# EAGLE design 2MBSIMMDIP (EAGLE 6.6.0)
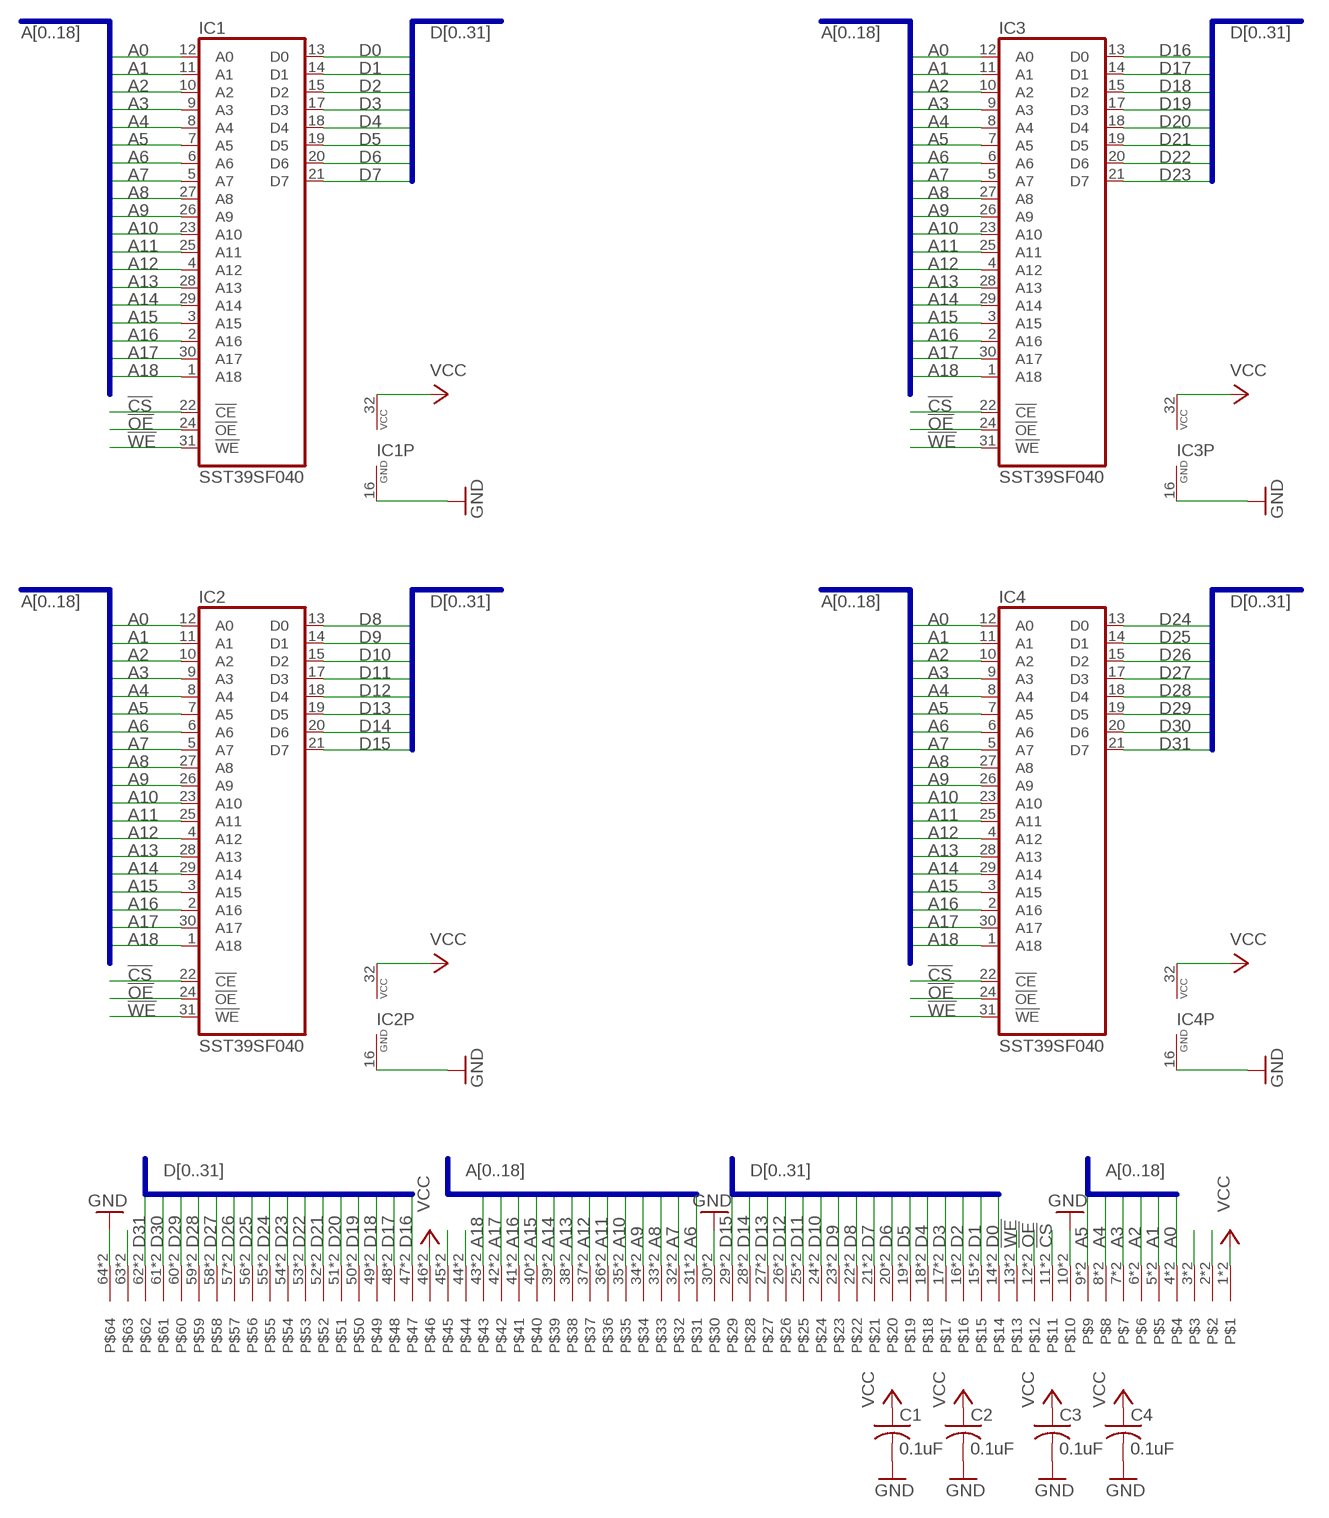
[diagram p0: schematic, sheet 1]

## Parts
C1  0.1uF  C-USC1206  [C1206]
C2  0.1uF  C-USC1206  [C1206]
C3  0.1uF  C-USC1206  [C1206]
C4  0.1uF  C-USC1206  [C1206]
CON1  MYSIMM  [SIMM64L]
IC1  SST39SF040  [DIL32-6]
IC2  SST39SF040  [DIL32-6]
IC3  SST39SF040  [DIL32-6]
IC4  SST39SF040  [DIL32-6]

## Nets
!CS: CON1.11 CON1.75 IC1.22(!CE) IC2.22(!CE) IC3.22(!CE) IC4.22(!CE)
!OE: CON1.12 CON1.76 IC1.24(!OE) IC2.24(!OE) IC3.24(!OE) IC4.24(!OE)
!WE: CON1.13 CON1.77 IC1.31(!WE) IC2.31(!WE) IC3.31(!WE) IC4.31(!WE)
A0: CON1.4 CON1.68 IC1.12(A0) IC2.12(A0) IC3.12(A0) IC4.12(A0)
A1: CON1.5 CON1.69 IC1.11(A1) IC2.11(A1) IC3.11(A1) IC4.11(A1)
A2: CON1.6 CON1.70 IC1.10(A2) IC2.10(A2) IC3.10(A2) IC4.10(A2)
A3: CON1.7 CON1.71 IC1.9(A3) IC2.9(A3) IC3.9(A3) IC4.9(A3)
A4: CON1.8 CON1.72 IC1.8(A4) IC2.8(A4) IC3.8(A4) IC4.8(A4)
A5: CON1.9 CON1.73 IC1.7(A5) IC2.7(A5) IC3.7(A5) IC4.7(A5)
A6: CON1.31 CON1.95 IC1.6(A6) IC2.6(A6) IC3.6(A6) IC4.6(A6)
A7: CON1.32 CON1.96 IC1.5(A7) IC2.5(A7) IC3.5(A7) IC4.5(A7)
A8: CON1.33 CON1.97 IC1.27(A8) IC2.27(A8) IC3.27(A8) IC4.27(A8)
A9: CON1.34 CON1.98 IC1.26(A9) IC2.26(A9) IC3.26(A9) IC4.26(A9)
A10: CON1.35 CON1.99 IC1.23(A10) IC2.23(A10) IC3.23(A10) IC4.23(A10)
A11: CON1.36 CON1.100 IC1.25(A11) IC2.25(A11) IC3.25(A11) IC4.25(A11)
A12: CON1.37 CON1.101 IC1.4(A12) IC2.4(A12) IC3.4(A12) IC4.4(A12)
A13: CON1.38 CON1.102 IC1.28(A13) IC2.28(A13) IC3.28(A13) IC4.28(A13)
A14: CON1.39 CON1.103 IC1.29(A14) IC2.29(A14) IC3.29(A14) IC4.29(A14)
A15: CON1.40 CON1.104 IC1.3(A15) IC2.3(A15) IC3.3(A15) IC4.3(A15)
A16: CON1.41 CON1.105 IC1.2(A16) IC2.2(A16) IC3.2(A16) IC4.2(A16)
A17: CON1.42 CON1.106 IC1.30(A17) IC2.30(A17) IC3.30(A17) IC4.30(A17)
A18: CON1.43 CON1.107 IC1.1(A18) IC2.1(A18) IC3.1(A18) IC4.1(A18)
D0: CON1.14 CON1.78 IC1.13(D0)
D1: CON1.15 CON1.79 IC1.14(D1)
D2: CON1.16 CON1.80 IC1.15(D2)
D3: CON1.17 CON1.81 IC1.17(D3)
D4: CON1.18 CON1.82 IC1.18(D4)
D5: CON1.19 CON1.83 IC1.19(D5)
D6: CON1.20 CON1.84 IC1.20(D6)
D7: CON1.21 CON1.85 IC1.21(D7)
D8: CON1.22 CON1.86 IC2.13(D0)
D9: CON1.23 CON1.87 IC2.14(D1)
D10: CON1.24 CON1.88 IC2.15(D2)
D11: CON1.25 CON1.89 IC2.17(D3)
D12: CON1.26 CON1.90 IC2.18(D4)
D13: CON1.27 CON1.91 IC2.19(D5)
D14: CON1.28 CON1.92 IC2.20(D6)
D15: CON1.29 CON1.93 IC2.21(D7)
D16: CON1.47 CON1.111 IC3.13(D0)
D17: CON1.48 CON1.112 IC3.14(D1)
D18: CON1.49 CON1.113 IC3.15(D2)
D19: CON1.50 CON1.114 IC3.17(D3)
D20: CON1.51 CON1.115 IC3.18(D4)
D21: CON1.52 CON1.116 IC3.19(D5)
D22: CON1.53 CON1.117 IC3.20(D6)
D23: CON1.54 CON1.118 IC3.21(D7)
D24: CON1.55 CON1.119 IC4.13(D0)
D25: CON1.56 CON1.120 IC4.14(D1)
D26: CON1.57 CON1.121 IC4.15(D2)
D27: CON1.58 CON1.122 IC4.17(D3)
D28: CON1.59 CON1.123 IC4.18(D4)
D29: CON1.60 CON1.124 IC4.19(D5)
D30: CON1.61 CON1.125 IC4.20(D6)
D31: CON1.62 CON1.126 IC4.21(D7)
GND [thicker]: C1.2 C2.2 C3.2 C4.2 CON1.10 CON1.30 CON1.64 CON1.74 CON1.94 CON1.128 IC1.16(GND) IC2.16(GND) IC3.16(GND) IC4.16(GND)
UNUSED1: CON1.2 CON1.66
UNUSED2: CON1.3 CON1.67
UNUSED3: CON1.63 CON1.127
UNUSED4: CON1.44 CON1.108
UNUSED5: CON1.45 CON1.109
VCC [thicker]: C1.1 C2.1 C3.1 C4.1 CON1.1 CON1.46 CON1.65 CON1.110 IC1.32(VCC) IC2.32(VCC) IC3.32(VCC) IC4.32(VCC)

## Buses
A[0..18]
D[0..31]

## Library data of the parts
C1-C4 = resistor:C-US: CAPACITOR, American symbol
CON1 = 2MBSIMMDIP:MYSIMM: 64-Pin SIMM
IC1-IC4 = dip_simm:SST39SF040: 4-Megabit FLASH MEMORY (512 K x 8 bit) 5 V-only

## Net classes
0 default: width 0.178 mm, drill 0.305 mm, clearance 0.178 mm
1 thicker: width 0.305 mm, drill 0.305 mm, clearance 0.178 mm

## Board
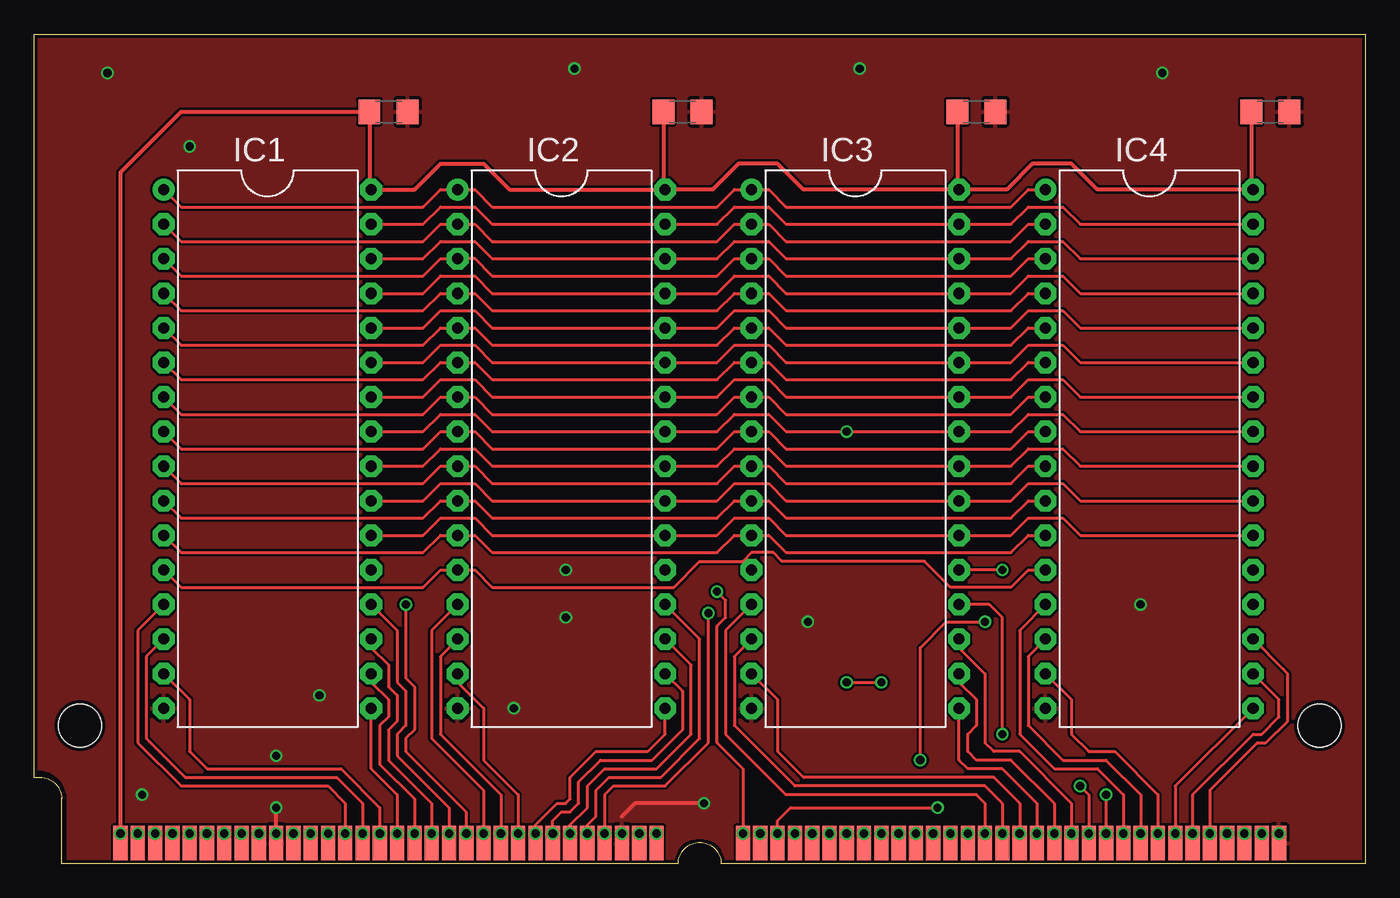
[diagram p1: board, top side]
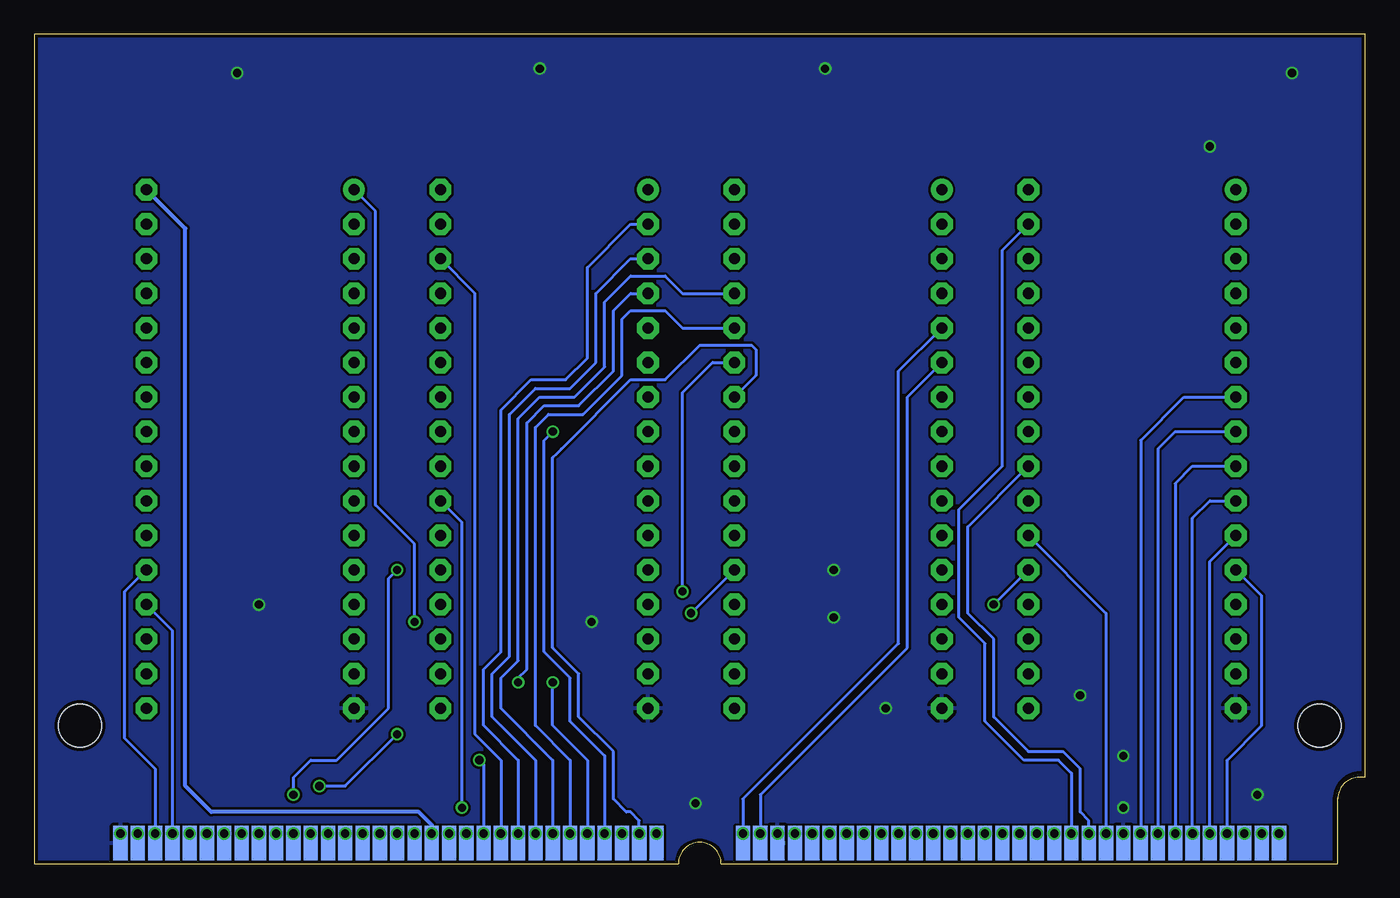
[diagram p2: board, bottom side, seen from below]

Size 97.79 x 60.96 mm. Coordinates in mm from the lower left corner, seen from the top.
Copper layers (1*16): Top 0.035mm / dielectric 1.5mm / Bottom 0.035mm
Design rules "SeeedStudio_2layer_DRU_no_angle_20140221": minimum track width 6mil, minimum drill 12mil, track to track 6mil, track to pad 6mil, pad to pad 6mil, via to via 6mil, smd to smd 0mil, copper to edge 10mil, drill to drill 10mil, minimum pad ring 10mil, minimum via ring 6mil, stop-mask expansion 2mil, vias tented up to drill 100mil, thermal gap 10mil

### Footprints (pad centres in the part's own frame; a part is rotated, then mirrored left to right if it is on the bottom)
C1206 = smd 1.6 x 1.8: 1 -1.4,0; 2 1.4,0
SIMM64L = smd 1.041 x 2.54: 1 -42.545,-8.636; 2 -41.275,-8.636; 3 -40.005,-8.636; 4 -38.735,-8.636; 5 -37.465,-8.636; 6 -36.195,-8.636; 7 -34.925,-8.636; 8 -33.655,-8.636; 9 -32.385,-8.636; 10 -31.115,-8.636; 11 -29.845,-8.636; 12 -28.575,-8.636; 13 -27.305,-8.636; 14 -26.035,-8.636; 15 -24.765,-8.636; 16 -23.495,-8.636; 17 -22.225,-8.636; 18 -20.955,-8.636; 19 -19.685,-8.636; 20 -18.415,-8.636; 21 -17.145,-8.636; 22 -15.875,-8.636; 23 -14.605,-8.636; 24 -13.335,-8.636; 25 -12.065,-8.636; 26 -10.795,-8.636; 27 -9.525,-8.636; 28 -8.255,-8.636; 29 -6.985,-8.636; 30 -5.715,-8.636; 31 -4.445,-8.636; 32 -3.175,-8.636; 33 3.175,-8.636; 34 4.445,-8.636; 35 5.715,-8.636; 36 6.985,-8.636; 37 8.255,-8.636; 38 9.525,-8.636; 39 10.795,-8.636; 40 12.065,-8.636; 41 13.335,-8.636; 42 14.605,-8.636; 43 15.875,-8.636; 44 17.145,-8.636; 45 18.415,-8.636; 46 19.685,-8.636; 47 20.955,-8.636; 48 22.225,-8.636; 49 23.495,-8.636; 50 24.765,-8.636; 51 26.035,-8.636; 52 27.305,-8.636; 53 28.575,-8.636; 54 29.845,-8.636; 55 31.115,-8.636; 56 32.385,-8.636; 57 33.655,-8.636; 58 34.925,-8.636; 59 36.195,-8.636; 60 37.465,-8.636; 61 38.735,-8.636; 62 40.005,-8.636; 63 41.275,-8.636; 64 42.545,-8.636 | smd 1.041 x 2.54 bottom: 65 -42.545,-8.636; 66 -41.275,-8.636; 67 -40.005,-8.636; 68 -38.735,-8.636; 69 -37.465,-8.636; 70 -36.195,-8.636; 71 -34.925,-8.636; 72 -33.655,-8.636; 73 -32.385,-8.636; 74 -31.115,-8.636; 75 -29.845,-8.636; 76 -28.575,-8.636; 77 -27.305,-8.636; 78 -26.035,-8.636; 79 -24.765,-8.636; 80 -23.495,-8.636; 81 -22.225,-8.636; 82 -20.955,-8.636; 83 -19.685,-8.636; 84 -18.415,-8.636; 85 -17.145,-8.636; 86 -15.875,-8.636; 87 -14.605,-8.636; 88 -13.335,-8.636; 89 -12.065,-8.636; 90 -10.795,-8.636; 91 -9.525,-8.636; 92 -8.255,-8.636; 93 -6.985,-8.636; 94 -5.715,-8.636; 95 -4.445,-8.636; 96 -3.175,-8.636; 97 3.175,-8.636; 98 4.445,-8.636; 99 5.715,-8.636; 100 6.985,-8.636; 101 8.255,-8.636; 102 9.525,-8.636; 103 10.795,-8.636; 104 12.065,-8.636; 105 13.335,-8.636; 106 14.605,-8.636; 107 15.875,-8.636; 108 17.145,-8.636; 109 18.415,-8.636; 110 19.685,-8.636; 111 20.955,-8.636; 112 22.225,-8.636; 113 23.495,-8.636; 114 24.765,-8.636; 115 26.035,-8.636; 116 27.305,-8.636; 117 28.575,-8.636; 118 29.845,-8.636; 119 31.115,-8.636; 120 32.385,-8.636; 121 33.655,-8.636; 122 34.925,-8.636; 123 36.195,-8.636; 124 37.465,-8.636; 125 38.735,-8.636; 126 40.005,-8.636; 127 41.275,-8.636; 128 42.545,-8.636 | hole 3.175: 45.517,0; -45.517,0
DIL32-6 = drill 0.813 pad 1.6: 1 -19.05,-7.62 | drill 0.813 pad 1.6 octagon: 2 -16.51,-7.62; 3 -13.97,-7.62; 4 -11.43,-7.62; 5 -8.89,-7.62; 6 -6.35,-7.62; 7 -3.81,-7.62; 8 -1.27,-7.62; 9 1.27,-7.62; 10 3.81,-7.62; 11 6.35,-7.62; 12 8.89,-7.62; 13 11.43,-7.62; 14 13.97,-7.62; 15 16.51,-7.62; 16 19.05,-7.62; 17 19.05,7.62; 18 16.51,7.62; 19 13.97,7.62; 20 11.43,7.62; 21 8.89,7.62; 22 6.35,7.62; 23 3.81,7.62; 24 1.27,7.62; 25 -1.27,7.62; 26 -3.81,7.62; 27 -6.35,7.62; 28 -8.89,7.62; 29 -11.43,7.62; 30 -13.97,7.62; 31 -16.51,7.62; 32 -19.05,7.62

### Placement (x,y rotation side)
C1  26.04,55.24 0 top
C2  47.62,55.24 0 top
C3  69.22,55.24 0 top
C4  90.81,55.24 0 top
CON1  48.9,10.16 0 top
IC1  17.15,30.48 270 top
IC2  38.73,30.48 270 top
IC3  60.33,30.48 270 top
IC4  81.91,30.48 270 top

### Tracks (layer width: path | path; a pad name or v marks a point on that pad's centre or on a via)
!CS  (via drill 0.6)
  Top 0.203: IC1.22 28.58,24.13 29.85,25.4 32.39,25.4 33.66,24.13 IC2.22 50.16,24.13 51.44,25.4 53.98,25.4 55.25,24.13 IC3.22 71.75,24.13 73.03,25.4 75.56,25.4 76.84,24.13 IC4.22 | v19.05,2.22 CON1.75
  Bottom 0.203: CON1.75 v19.05,2.22 19.05,18.41 IC1.22
!OE  (via drill 0.6)
  Top 0.203: IC1.24 28.58,29.21 29.85,30.48 32.39,30.48 33.66,29.21 IC2.24 50.16,29.21 51.44,30.48 53.98,30.48 55.25,29.21 IC3.24 71.75,29.21 73.03,30.48 75.56,30.48 76.84,29.21 IC4.24 | v20.32,2.22 CON1.76
  Bottom 0.203: IC1.24 29.21,24.77 29.21,18.41 27.31,16.51 27.31,10.79 24.77,8.26 22.23,8.26 20.96,6.99 20.96,3.81 20.32,3.17 v20.32,2.22 CON1.76
!WE  (via drill 0.6)
  Top 0.203: IC1.31 28.58,46.99 29.85,48.26 32.39,48.26 33.66,46.99 IC2.31 50.16,46.99 51.44,48.26 53.98,48.26 55.25,46.99 IC3.31 71.75,46.99 73.03,48.26 75.56,48.26 76.84,46.99 IC4.31 | v21.59,2.22 CON1.77
  Bottom 0.203: CON1.77 v21.59,2.22 21.59,6.67 22.54,7.62 25.08,7.62 27.94,10.48 27.94,16.19 29.85,18.1 29.85,26.04 26.67,29.21 26.67,45.09 IC1.31
A0  (via drill 0.6)
  Top 0.203: IC1.12 10.8,20.32 28.58,20.32 29.85,21.59 IC2.12 32.39,21.59 33.66,20.32 46.99,20.32 48.9,22.23 52.07,22.23 | IC4.12 73.03,21.59 71.75,20.32 67.31,20.32 65.41,22.23 54.93,22.23 54.29,22.86 52.71,22.86 52.07,22.23 | v10.16,2.22 CON1.68 | 52.07,22.23 IC3.12
  Bottom 0.203: CON1.68 v10.16,2.22 10.16,7.62 7.62,10.16 7.62,19.68 IC1.12
A1  (via drill 0.6)
  Top 0.203: IC1.11 10.8,22.86 28.58,22.86 29.85,24.13 IC2.11 32.39,24.13 33.66,22.86 50.16,22.86 51.44,24.13 IC3.11 53.98,24.13 55.25,22.86 71.75,22.86 73.03,24.13 IC4.11 | v11.43,2.22 CON1.69
  Bottom 0.203: CON1.69 v11.43,2.22 11.43,22.23 IC1.11
A2  (via drill 0.6)
  Top 0.203: IC1.10 10.8,25.4 28.58,25.4 29.85,26.67 IC2.10 32.39,26.67 33.66,25.4 50.16,25.4 51.44,26.67 IC3.10 53.98,26.67 55.25,25.4 71.75,25.4 73.03,26.67 IC4.10 | v12.7,2.22 CON1.70
  Bottom 0.203: CON1.70 v12.7,2.22 12.7,25.4 11.43,26.67 IC1.10
A3  (via drill 0.6)
  Top 0.203: IC1.9 10.8,27.94 28.58,27.94 29.85,29.21 IC2.9 32.39,29.21 33.66,27.94 50.16,27.94 51.44,29.21 IC3.9 53.98,29.21 55.25,27.94 71.75,27.94 73.03,29.21 IC4.9 | v13.97,2.22 CON1.71
  Bottom 0.203: CON1.71 v13.97,2.22 13.97,27.94 12.7,29.21 IC1.9
A4  (via drill 0.6)
  Top 0.203: IC1.8 10.8,30.48 28.58,30.48 29.85,31.75 IC2.8 32.39,31.75 33.66,30.48 50.16,30.48 51.44,31.75 IC3.8 53.98,31.75 55.25,30.48 71.75,30.48 73.03,31.75 IC4.8 | v15.24,2.22 CON1.72
  Bottom 0.203: CON1.72 v15.24,2.22 15.24,30.48 13.97,31.75 IC1.8
A5  (via drill 0.6)
  Top 0.203: IC1.7 10.8,33.02 28.58,33.02 29.85,34.29 IC2.7 32.39,34.29 33.66,33.02 50.16,33.02 51.44,34.29 IC3.7 53.98,34.29 55.25,33.02 71.75,33.02 73.03,34.29 IC4.7 | 16.51,1.91 CON1.73 v16.51,2.22
  Bottom 0.203: CON1.73 v16.51,2.22 16.51,31.11 13.34,34.29 IC1.7
A6  (via drill 0.6)
  Top 0.203: IC1.6 10.8,35.56 28.58,35.56 29.85,36.83 IC2.6 32.39,36.83 33.66,35.56 50.16,35.56 51.44,36.83 IC3.6 53.98,36.83 55.25,35.56 71.75,35.56 73.03,36.83 IC4.6 | v44.45,2.22 CON1.95
  Bottom 0.203: CON1.95 v44.45,2.22 44.45,5.08 33.66,15.88 33.66,34.29 IC2.6
A7  (via drill 0.6)
  Top 0.203: IC1.5 10.8,38.1 28.58,38.1 29.85,39.37 IC2.5 32.39,39.37 33.66,38.1 50.16,38.1 51.44,39.37 IC3.5 53.98,39.37 55.25,38.1 71.75,38.1 73.03,39.37 IC4.5 | v45.72,2.22 CON1.96
  Bottom 0.203: CON1.96 v45.72,2.22 45.72,4.76 34.29,16.19 34.29,36.2 IC2.5
A8  (via drill 0.6)
  Top 0.203: IC1.27 28.58,36.83 29.85,38.1 32.39,38.1 33.66,36.83 IC2.27 50.16,36.83 51.44,38.1 53.98,38.1 55.25,36.83 IC3.27 71.75,36.83 73.03,38.1 75.56,38.1 76.84,36.83 IC4.27 | CON1.97 v52.07,2.22 52.07,6.99 50.16,8.89 50.16,17.46 50.8,18.1 50.8,19.37 v50.16,20
  Bottom 0.203: IC2.27 47.94,36.83 50.16,34.61 v50.16,20 | CON1.97 v52.07,2.22
A9  (via drill 0.6)
  Top 0.203: IC1.26 28.58,34.29 29.85,35.56 32.39,35.56 33.66,34.29 IC2.26 50.16,34.29 51.44,35.56 53.98,35.56 55.25,34.29 IC3.26 71.75,34.29 73.03,35.56 75.56,35.56 76.84,34.29 IC4.26 | CON1.98 v53.34,2.22
  Bottom 0.203: CON1.98 v53.34,2.22 53.34,3.17 53.98,3.81 54.29,3.81 55.25,4.76 55.25,8.26 57.79,10.79 57.79,13.97 59.69,15.88 59.69,29.84 59.37,30.16 59.05,30.48 53.98,35.56 51.44,35.56 48.9,38.1 45.09,38.1 44.77,37.78 44.77,35.88 IC2.26
A10  (via drill 0.6)
  Top 0.203: IC1.23 28.58,26.67 29.85,27.94 32.39,27.94 33.66,26.67 IC2.23 50.16,26.67 51.44,27.94 53.98,27.94 55.25,26.67 IC3.23 71.75,26.67 73.03,27.94 75.56,27.94 76.84,26.67 IC4.23 | CON1.99 v54.61,2.22 54.61,3.17 55.56,4.13 v66.36,4.13
  Bottom 0.203: v54.61,2.22 CON1.99 | v66.36,4.13 66.36,25.08 IC3.23
A11  (via drill 0.6)
  Top 0.203: IC1.25 28.58,31.75 29.85,33.02 32.39,33.02 33.66,31.75 IC2.25 50.16,31.75 51.44,33.02 53.98,33.02 55.25,31.75 v59.69,31.75 IC3.25 71.75,31.75 73.03,33.02 75.56,33.02 76.84,31.75 IC4.25 | v55.88,2.22 CON1.100
  Bottom 0.203: CON1.100 v55.88,2.22 55.88,7.94 58.42,10.48 58.42,13.65 60.33,15.56 60.33,31.11 v59.69,31.75
A12  (via drill 0.6)
  Top 0.203: IC1.4 10.8,40.64 28.58,40.64 29.85,41.91 IC2.4 32.39,41.91 33.66,40.64 50.16,40.64 51.44,41.91 IC3.4 53.98,41.91 55.25,40.64 71.75,40.64 73.03,41.91 IC4.4 | v57.15,2.22 CON1.101 | v59.69,13.34 v62.23,13.34
  Bottom 0.203: CON1.101 v57.15,2.22 57.15,7.62 59.69,10.16 v59.69,13.34 | IC3.4 53.98,41.91 55.25,40.64 55.25,36.2 57.79,33.66 60.33,33.66 61.59,32.38 61.59,14.29 62.23,13.65 v62.23,13.34
A13  (via drill 0.6)
  Top 0.203: IC1.28 28.58,39.37 29.85,40.64 32.39,40.64 33.66,39.37 IC2.28 50.16,39.37 51.44,40.64 53.98,40.64 55.25,39.37 IC3.28 71.75,39.37 73.03,40.64 75.56,40.64 76.84,39.37 IC4.28 | v58.42,2.22 CON1.102
  Bottom 0.203: IC2.28 50.16,39.37 51.44,40.64 53.98,40.64 54.61,40.01 54.61,35.88 57.47,33.02 60.01,33.02 60.96,32.07 60.96,10.16 58.42,7.62 v58.42,2.22 CON1.102
A14  (via drill 0.6)
  Top 0.203: IC1.29 28.58,41.91 29.85,43.18 32.39,43.18 33.66,41.91 IC2.29 50.16,41.91 51.44,43.18 53.98,43.18 55.25,41.91 IC3.29 71.75,41.91 73.03,43.18 75.56,43.18 76.84,41.91 IC4.29 | v59.69,2.22 CON1.103
  Bottom 0.203: IC2.29 50.16,41.91 51.44,43.18 53.98,43.18 55.88,41.27 55.88,36.51 58.1,34.29 60.64,34.29 62.23,32.7 62.23,14.92 63.5,13.65 63.5,11.43 59.69,7.62 v59.69,2.22 CON1.103
A15  (via drill 0.6)
  Top 0.203: IC1.3 10.8,43.18 28.58,43.18 29.85,44.45 IC2.3 32.39,44.45 33.66,43.18 50.16,43.18 51.44,44.45 IC3.3 53.98,44.45 55.25,43.18 71.75,43.18 73.03,44.45 IC4.3 | v60.96,2.22 CON1.104
  Bottom 0.203: IC3.3 53.98,44.45 56.52,41.91 56.52,36.83 58.42,34.92 60.96,34.92 62.87,33.02 62.87,15.24 64.13,13.97 64.13,10.79 60.96,7.62 v60.96,2.22 CON1.104
A16  (via drill 0.6)
  Top 0.203: IC1.2 10.8,45.72 28.58,45.72 29.85,46.99 IC2.2 32.39,46.99 33.66,45.72 50.16,45.72 51.44,46.99 IC3.2 53.98,46.99 55.25,45.72 71.75,45.72 73.03,46.99 IC4.2 | v62.23,2.22 CON1.105
  Bottom 0.203: IC3.2 53.98,46.99 57.15,43.81 57.15,37.15 58.74,35.56 61.28,35.56 63.5,33.34 63.5,15.56 64.77,14.29 64.77,10.16 62.23,7.62 v62.23,2.22 CON1.105
A17  (via drill 0.6)
  Top 0.203: IC1.30 28.58,44.45 29.85,45.72 32.39,45.72 33.66,44.45 IC2.30 50.16,44.45 51.44,45.72 53.98,45.72 55.25,44.45 IC3.30 71.75,44.45 73.03,45.72 75.56,45.72 76.84,44.45 IC4.30 | v63.5,2.22 CON1.106
  Bottom 0.203: IC3.30 65.41,41.91 65.41,9.53 63.5,7.62 v63.5,2.22 CON1.106
A18  (via drill 0.6)
  Top 0.203: IC1.1 10.8,48.26 28.58,48.26 29.85,49.53 IC2.1 32.39,49.53 33.66,48.26 50.16,48.26 51.44,49.53 IC3.1 53.98,49.53 55.25,48.26 71.75,48.26 73.03,49.53 IC4.1 | v64.77,2.22 CON1.107 | v65.09,7.62 65.09,15.88 66.99,17.78 v69.85,17.78
  Bottom 0.203: CON1.107 v64.77,2.22 64.77,7.3 v65.09,7.62 | v69.85,17.78 69.85,23.5 72.71,26.35 72.71,47.94 IC4.1
D0  (via drill 0.6)
  Top 0.203: IC1.13 7.62,17.14 7.62,8.89 10.8,5.71 21.59,5.71 22.86,4.45 v22.86,2.22 CON1.78
  Bottom 0.203: CON1.78 v22.86,2.22
D1  (via drill 0.6)
  Top 0.203: IC1.14 8.26,15.24 8.26,9.21 11.11,6.35 22.23,6.35 24.13,4.45 v24.13,2.22 CON1.79
  Bottom 0.203: CON1.79 v24.13,2.22
D2  (via drill 0.6)
  Top 0.203: IC1.15 11.43,12.06 11.43,8.26 12.7,6.99 22.54,6.99 25.4,4.13 v25.4,2.22 CON1.80
  Bottom 0.203: CON1.80 v25.4,2.22
D3  (via drill 0.6)
  Top 0.203: CON1.81 v26.67,2.22 26.67,5.08 24.77,6.99 IC1.17
  Bottom 0.203: CON1.81 v26.67,2.22
D4  (via drill 0.6)
  Top 0.203: CON1.82 v27.94,2.22 27.94,4.76 25.4,7.3 25.4,10.16 26.04,10.79 26.04,12.06 24.77,13.34 IC1.18
  Bottom 0.203: CON1.82 v27.94,2.22
D5  (via drill 0.6)
  Top 0.203: IC1.19 24.77,15.88 26.04,14.61 26.04,13.02 26.67,12.38 26.67,10.48 26.04,9.84 26.04,7.62 29.21,4.45 v29.21,2.22 CON1.83
  Bottom 0.203: CON1.83 v29.21,2.22
D6  (via drill 0.6)
  Top 0.203: IC1.20 26.67,17.14 26.67,13.34 27.31,12.7 27.31,10.16 26.67,9.53 26.67,7.94 30.48,4.13 v30.48,2.22 CON1.84
  Bottom 0.203: CON1.84 v30.48,2.22
D7  (via drill 0.6)
  Top 0.203: CON1.85 v31.75,2.22 31.75,3.81 27.31,8.26 27.31,9.21 27.94,9.84 27.94,13.02 27.31,13.65 v27.31,19.05
  Bottom 0.203: v27.31,19.05 IC1.21 | CON1.85 v31.75,2.22
D8  (via drill 0.6)
  Top 0.203: IC2.13 29.21,17.14 29.21,9.21 33.02,5.4 v33.02,2.22 CON1.86
  Bottom 0.203: CON1.86 v33.02,2.22
D9  (via drill 0.6)
  Top 0.203: IC2.14 29.85,15.24 29.85,9.53 34.29,5.08 v34.29,2.22 CON1.87
  Bottom 0.203: CON1.87 v34.29,2.22
D10  (via drill 0.6)
  Top 0.203: IC2.15 31.12,13.34 33.02,11.43 33.02,7.62 35.56,5.08 v35.56,2.22 CON1.88
  Bottom 0.203: CON1.88 v35.56,2.22
D11  (via drill 0.6)
  Top 0.203: CON1.89 v36.83,2.22 36.83,2.86 38.42,4.45 39.05,4.45 39.37,4.76 39.37,6.35 41.27,8.26 45.09,8.26 46.36,9.53 IC2.17
  Bottom 0.203: CON1.89 v36.83,2.22
D12  (via drill 0.6)
  Top 0.203: IC2.18 47.62,12.7 47.62,9.84 45.4,7.62 41.59,7.62 40.01,6.03 40.01,4.45 39.37,3.81 38.73,3.81 38.1,3.17 v38.1,2.22 CON1.90
  Bottom 0.203: CON1.90 v38.1,2.22
D13  (via drill 0.6)
  Top 0.203: CON1.91 v39.37,2.22 39.37,2.86 40.64,4.13 40.64,5.71 41.91,6.99 45.72,6.99 48.26,9.53 48.26,14.61 IC2.19
  Bottom 0.203: CON1.91 v39.37,2.22
D14  (via drill 0.6)
  Top 0.203: CON1.92 v40.64,2.22 40.64,2.86 41.27,3.49 41.27,5.4 42.23,6.35 46.04,6.35 48.9,9.21 48.9,16.51 IC2.20
  Bottom 0.203: CON1.92 v40.64,2.22
D15  (via drill 0.6)
  Top 0.203: CON1.93 v41.91,2.22 41.91,5.08 42.55,5.71 46.36,5.71 49.53,8.89 v49.53,18.41
  Bottom 0.203: v49.53,18.41 IC2.21 | CON1.93 v41.91,2.22
D16  (via drill 0.6)
  Top 0.203: IC3.13 50.8,17.14 50.8,9.53 55.25,5.08 69.22,5.08 69.85,4.45 v69.85,2.22 CON1.111
  Bottom 0.203: CON1.111 v69.85,2.22
D17  (via drill 0.6)
  Top 0.203: IC3.14 51.44,15.24 51.44,10.16 55.88,5.71 69.85,5.71 71.12,4.45 v71.12,2.22 CON1.112
  Bottom 0.203: CON1.112 v71.12,2.22
D18  (via drill 0.6)
  Top 0.203: IC3.15 54.61,12.06 54.61,8.26 56.52,6.35 70.49,6.35 72.39,4.45 v72.39,2.22 CON1.113
  Bottom 0.203: CON1.113 v72.39,2.22
D19  (via drill 0.6)
  Top 0.203: IC3.17 67.94,7.62 68.58,6.99 71.12,6.99 73.66,4.45 v73.66,2.22 CON1.114
  Bottom 0.203: CON1.114 v73.66,2.22
D20  (via drill 0.6)
  Top 0.203: IC3.18 67.94,13.34 69.22,12.06 69.22,10.16 68.58,9.53 68.58,8.26 69.22,7.62 71.75,7.62 74.93,4.45 v74.93,2.22 CON1.115
  Bottom 0.203: CON1.115 v74.93,2.22
D21  (via drill 0.6)
  Top 0.203: IC3.19 67.94,15.88 69.85,13.97 69.85,8.89 70.49,8.26 72.39,8.26 76.2,4.45 v76.2,2.22 CON1.116
  Bottom 0.203: CON1.116 v76.2,2.22
D22  (via drill 0.6)
  Top 0.203: v76.84,5.71 77.47,5.08 v77.47,2.22 CON1.117 | v71.12,9.53 71.12,18.1 70.17,19.05 IC3.20
  Bottom 0.203: v76.84,5.71 74.93,5.71 v71.12,9.53 | CON1.117 v77.47,2.22
D23  (via drill 0.6)
  Top 0.203: v71.12,21.59 IC3.21 | v78.74,5.08 v78.74,2.22 CON1.118
  Bottom 0.203: v78.74,5.08 78.74,6.35 77.47,7.62 75.56,7.62 71.75,11.43 71.75,20.95 v71.12,21.59 | CON1.118 v78.74,2.22
D24  (via drill 0.6)
  Top 0.203: IC4.13 72.39,17.14 72.39,9.53 74.93,6.99 78.1,6.99 80.01,5.08 v80.01,2.22 CON1.119
  Bottom 0.203: CON1.119 v80.01,2.22
D25  (via drill 0.6)
  Top 0.203: IC4.14 73.03,15.24 73.03,10.16 75.56,7.62 78.74,7.62 81.28,5.08 v81.28,2.22 CON1.120
  Bottom 0.203: CON1.120 v81.28,2.22
D26  (via drill 0.6)
  Top 0.203: IC4.15 76.2,12.06 76.2,9.53 77.47,8.26 79.38,8.26 82.55,5.08 v82.55,2.22 CON1.121
  Bottom 0.203: CON1.121 v82.55,2.22
D27  (via drill 0.6)
  Top 0.203: IC4.17 83.82,5.71 v83.82,2.22 CON1.122
  Bottom 0.203: CON1.122 v83.82,2.22
D28  (via drill 0.6)
  Top 0.203: IC4.18 91.44,12.06 91.44,10.79 90.17,9.53 89.53,9.53 85.09,5.08 v85.09,2.22 CON1.123
  Bottom 0.203: CON1.123 v85.09,2.22
D29  (via drill 0.6)
  Top 0.203: IC4.19 91.76,14.29 92.07,13.97 92.07,10.48 90.49,8.89 89.85,8.89 86.36,5.4 v86.36,2.22 CON1.124
  Bottom 0.203: CON1.124 v86.36,2.22
D30  (via drill 0.6)
  Top 0.203: v87.63,2.22 CON1.125
  Bottom 0.203: IC4.20 87.63,17.14 v87.63,2.22 CON1.125
D31  (via drill 0.6)
  Top 0.203: v88.9,2.22 CON1.126
  Bottom 0.203: IC4.21 91.12,20 91.12,9.21 88.9,6.99 v88.9,2.22 CON1.126
GND  (via drill 0.6)
  Top 0.305: CON1.74 v17.78,4.13 | v49.21,4.45 44.13,4.45 43.18,3.49
  Bottom 0.305: CON1.74 v17.78,2.22
  other vias: 17.78,7.94 20.96,12.38 7.94,5.08 39.05,18.1 35.24,11.43 43.18,2.22 91.44,2.22 56.83,17.78 39.05,21.59 11.43,52.7 5.4,58.1 39.69,58.42 60.64,58.42 82.87,58.1 81.28,19.05
  pour Top: 2.54,0.32 2.54,4.76 arc90 0.32,6.99 0.32,60.64 97.47,60.64 97.47,0.32 50.8,0.32 arc90 49.21,1.91 48.58,1.91 arc90 46.99,0.32
  pour Bottom: 2.54,0.32 2.54,4.76 arc90 0.32,6.99 0.32,60.64 97.47,60.64 97.47,0.32 50.8,0.32 arc90 49.21,1.91 48.9,1.91 48.58,1.91 arc90 46.99,0.32
UNUSED1  (via drill 0.6)
  Top 0.203: v7.62,2.22 CON1.66
  Bottom 0.203: v7.62,2.22 CON1.66
UNUSED2  (via drill 0.6)
  Top 0.203: v8.89,2.22 CON1.67
  Bottom 0.203: CON1.67 v8.89,2.22
UNUSED3  (via drill 0.6)
  Top 0.203: v90.17,2.22 CON1.127
  Bottom 0.203: CON1.127 v90.17,2.22
UNUSED4  (via drill 0.6)
  Top 0.203: v66.04,2.22 CON1.44
  Bottom 0.203: v66.04,2.22 CON1.44
UNUSED5  (via drill 0.6)
  Top 0.203: v67.31,2.22 CON1.45
  Bottom 0.203: v67.31,2.22 CON1.45
VCC  (via drill 0.6)
  Top 0.305: CON1.65 v6.35,2.22 6.35,50.8 10.8,55.24 C1.1 24.64,49.66 IC1.32 27.94,49.53 29.85,51.44 33.02,51.44 34.93,49.53 IC2.32 | C2.1 46.23,49.66 IC2.32 | IC3.32 56.52,49.53 54.61,51.44 51.75,51.44 49.85,49.53 IC2.32 | C3.1 67.81,49.66 IC3.32 | C4.1 89.41,49.66 IC4.32 78.1,49.53 76.2,51.44 73.34,51.44 71.44,49.53 IC3.32 | v68.58,2.22 CON1.110
  Bottom 0.305: CON1.65 v6.35,2.22 | IC4.32 86.68,46.67 86.68,5.71 84.77,3.81 69.53,3.81 68.58,2.86 v68.58,2.22 CON1.110